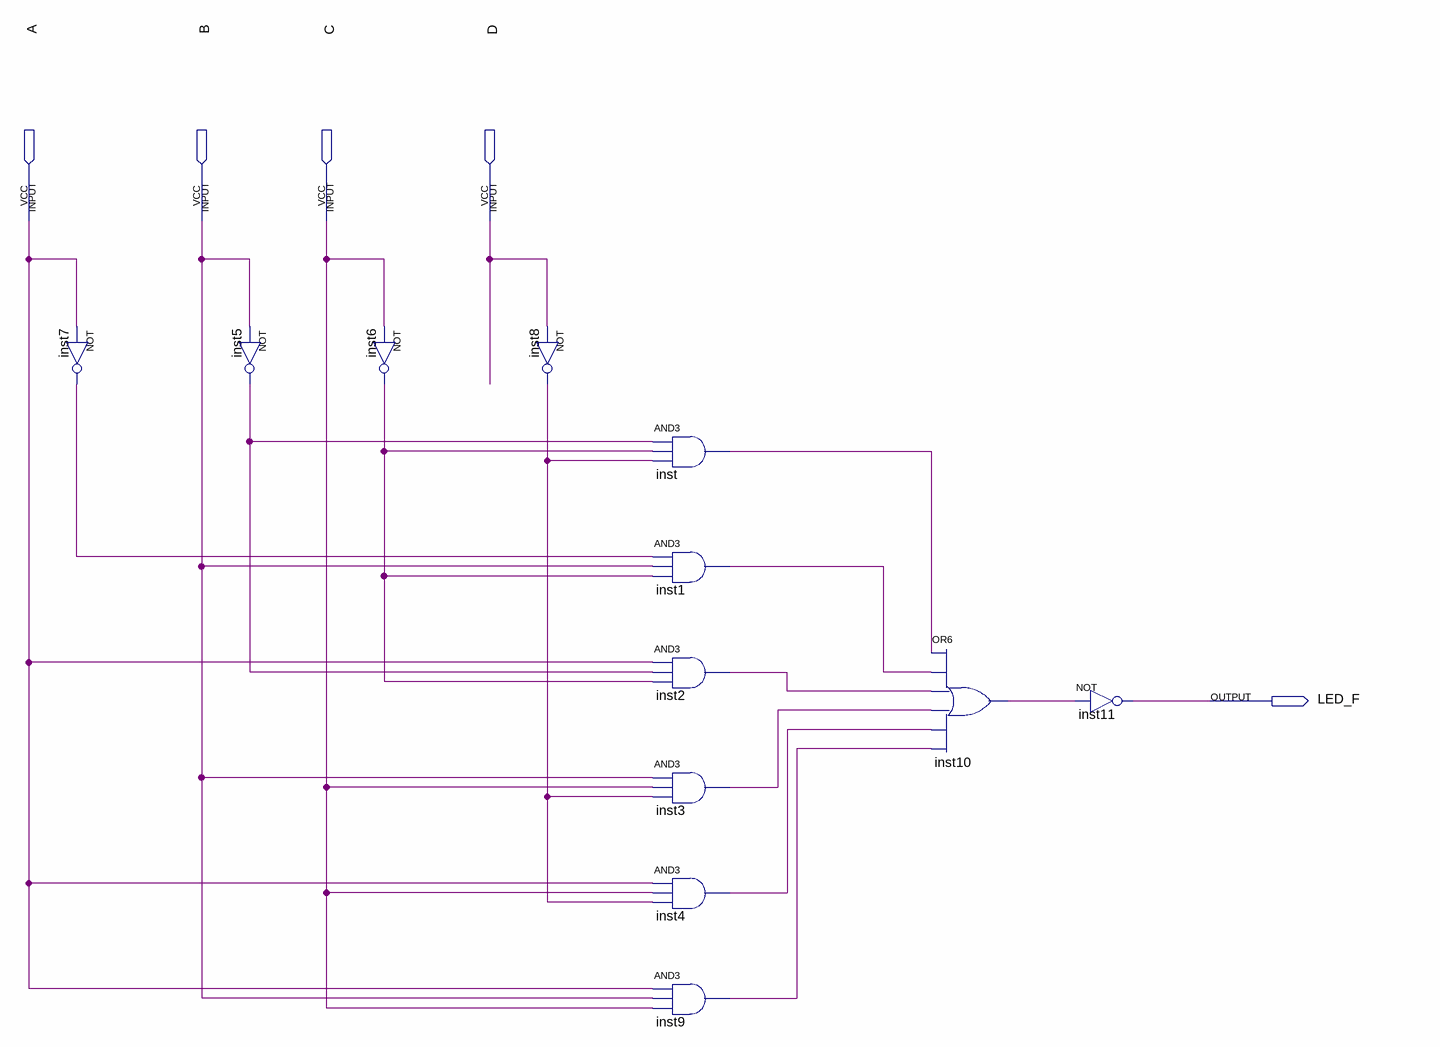
[diagram p0: schematic sheet]
// Quartus schematic led_f.bdf as structural Verilog: 12 symbols, 5 pins
module led_f (
  input  A,
  input  B,
  input  C,
  input  D,
  output LED_F
);

  wire inst1_out, inst2_out, inst3_out, inst4_out, inst5_out, inst6_out, inst7_out, inst8_out, inst9_out,
       inst10_out, inst_out;

  not inst7 (inst7_out, A);
  not inst5 (inst5_out, B);
  not inst6 (inst6_out, C);
  not inst8 (inst8_out, D);
  and inst (inst_out, inst5_out, inst6_out, inst8_out);
  and inst1 (inst1_out, inst7_out, B, inst6_out);
  and inst2 (inst2_out, A, inst5_out, inst6_out);
  and inst3 (inst3_out, B, C, inst8_out);
  and inst4 (inst4_out, A, C, inst8_out);
  and inst9 (inst9_out, A, B, C);
  or inst10 (inst10_out, inst_out, inst1_out, inst2_out, inst3_out, inst4_out, inst9_out);
  not inst11 (LED_F, inst10_out);
endmodule
